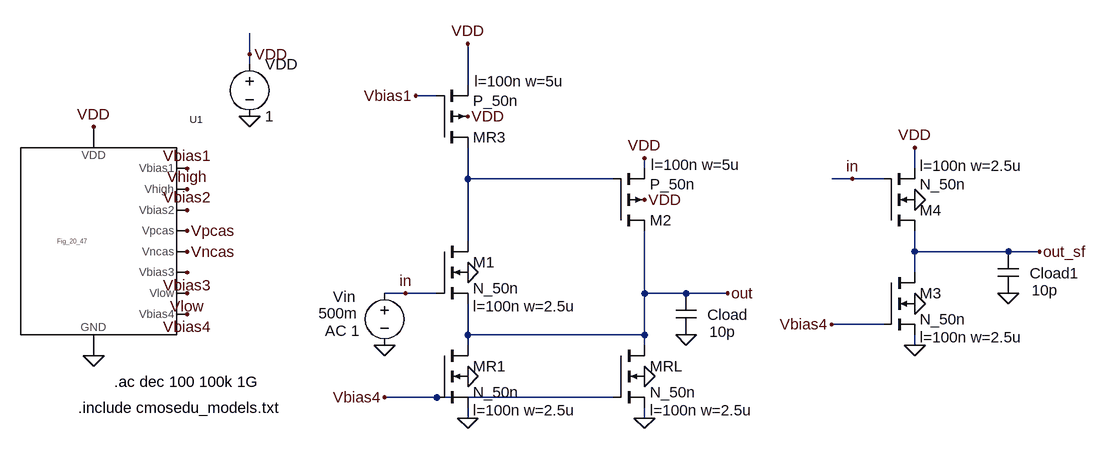
[diagram p0: schematic Fig31_46.asc]
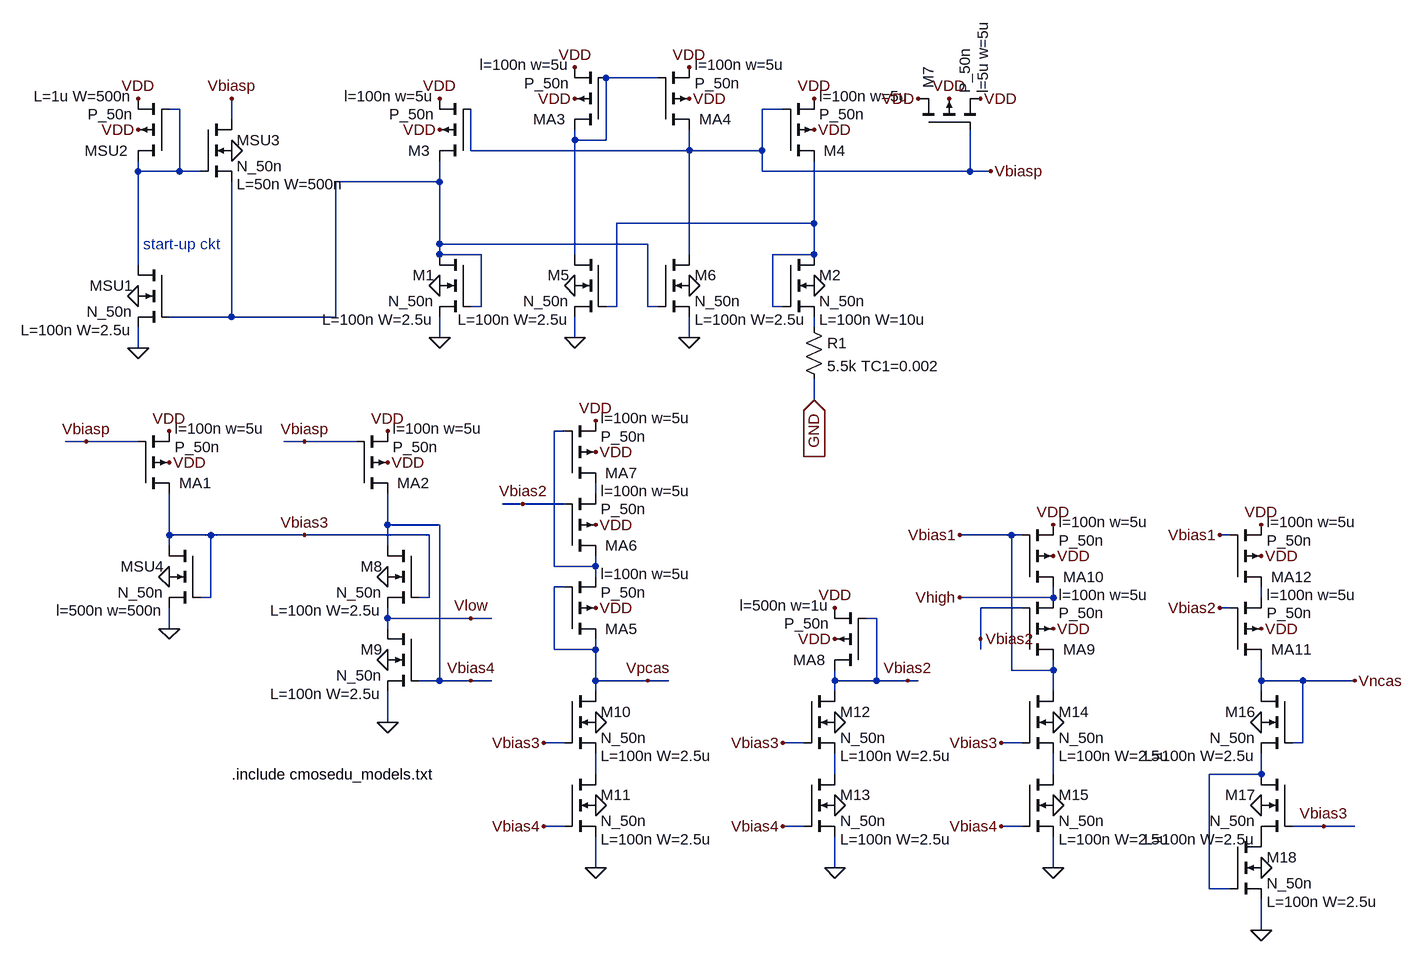
[diagram p1: sub-circuit fig_20_47.asc]
Fig31_46.asc, the LTspice schematic file:
Version 4
SHEET 1 2412 680
WIRE 1040 -352 1040 -384
WIRE 1040 -336 1040 -352
WIRE 1376 -304 1376 -368
WIRE 1328 -288 1296 -288
WIRE 1648 -176 1648 -192
WIRE 2064 -176 2064 -208
WIRE 1376 -160 1376 -208
WIRE 1600 -160 1376 -160
WIRE 1968 -160 1936 -160
WIRE 2016 -160 1968 -160
WIRE 1376 -64 1376 -160
WIRE 2064 -48 2064 -80
WIRE 2208 -48 2064 -48
WIRE 2256 -48 2208 -48
WIRE 2064 -16 2064 -48
WIRE 1280 16 1248 16
WIRE 1328 16 1280 16
WIRE 1648 16 1648 -80
WIRE 1712 16 1648 16
WIRE 1776 16 1712 16
WIRE 2016 64 1936 64
WIRE 1376 80 1376 32
WIRE 1648 80 1648 16
WIRE 1648 80 1376 80
WIRE 1376 96 1376 80
WIRE 1648 96 1648 80
WIRE 2064 96 2064 80
WIRE 1328 176 1248 176
WIRE 1600 176 1328 176
WIRE 1376 208 1376 192
WIRE 1648 208 1648 192
FLAG 1040 -256 0
FLAG 1040 -352 VDD
FLAG 1376 208 0
FLAG 1376 -368 VDD
FLAG 1376 -256 VDD
FLAG 800 -240 VDD
FLAG 800 112 0
FLAG 944 -176 Vbias1
FLAG 944 -144 Vhigh
FLAG 944 -112 Vbias2
FLAG 944 -16 Vbias3
FLAG 944 -80 Vpcas
FLAG 944 -48 Vncas
FLAG 944 48 Vbias4
FLAG 944 16 Vlow
FLAG 1376 144 0
FLAG 1248 176 Vbias4
FLAG 1296 -288 Vbias1
FLAG 1648 -192 VDD
FLAG 1648 -128 VDD
FLAG 1648 208 0
FLAG 1648 144 0
FLAG 1776 16 out
FLAG 1712 80 0
FLAG 1248 96 0
FLAG 1280 16 in
FLAG 2064 96 0
FLAG 2064 -128 0
FLAG 2064 32 0
FLAG 1936 64 Vbias4
FLAG 1968 -160 in
FLAG 2064 -208 VDD
FLAG 2256 -48 out_sf
FLAG 2208 16 0
FLAG 1376 -16 0
SYMBOL voltage 1040 -352 R0
WINDOW 123 0 0 Left 2
WINDOW 39 0 0 Left 2
SYMATTR InstName VDD
SYMATTR Value 1
SYMBOL pmos4 1328 -208 M180
WINDOW 123 58 102 Left 2
WINDOW 0 56 16 Left 2
SYMATTR Value2 l=100n w=5u
SYMATTR InstName MR3
SYMATTR Value P_50n
SYMBOL Fig_20_47 800 -64 R0
SYMATTR InstName U1
SYMBOL nmos4 1328 -64 R0
WINDOW 123 56 100 Left 2
SYMATTR Value2 l=100n w=2.5u
SYMATTR InstName M1
SYMATTR Value N_50n
SYMBOL nmos4 1328 96 R0
WINDOW 123 56 100 Left 2
SYMATTR Value2 l=100n w=2.5u
SYMATTR InstName MR1
SYMATTR Value N_50n
SYMBOL pmos4 1600 -80 M180
WINDOW 123 58 102 Left 2
WINDOW 0 56 16 Left 2
SYMATTR Value2 l=100n w=5u
SYMATTR InstName M2
SYMATTR Value P_50n
SYMBOL nmos4 1600 96 R0
WINDOW 123 56 100 Left 2
SYMATTR Value2 l=100n w=2.5u
SYMATTR InstName MRL
SYMATTR Value N_50n
SYMBOL cap 1696 16 R0
WINDOW 0 49 33 Left 2
WINDOW 3 52 59 Left 2
SYMATTR InstName Cload
SYMATTR Value 10p
SYMBOL voltage 1248 0 R0
WINDOW 0 -79 21 Left 2
WINDOW 3 -102 47 Left 2
WINDOW 123 -92 74 Left 2
WINDOW 39 0 0 Left 2
SYMATTR InstName Vin
SYMATTR Value 500m
SYMATTR Value2 AC 1
SYMBOL nmos4 2016 -80 M180
WINDOW 123 56 100 Left 2
SYMATTR Value2 l=100n w=2.5u
SYMATTR InstName M4
SYMATTR Value N_50n
SYMBOL nmos4 2016 -16 R0
WINDOW 123 56 100 Left 2
SYMATTR Value2 l=100n w=2.5u
SYMATTR InstName M3
SYMATTR Value N_50n
SYMBOL cap 2192 -48 R0
WINDOW 0 49 33 Left 2
WINDOW 3 52 59 Left 2
SYMATTR InstName Cload1
SYMATTR Value 10p
TEXT 776 192 Left 2 !.include cmosedu_models.txt
TEXT 832 152 Left 2 !.ac dec 100 100k 1G

fig_20_47.asc, the sub-circuit schematic file:
Version 4
SHEET 1 2512 1124
WIRE 1344 -208 1264 -208
WIRE 608 -160 592 -160
WIRE 1536 -160 1504 -160
WIRE 688 -144 688 -176
WIRE 1216 -112 1216 -128
WIRE 1264 -112 1264 -208
WIRE 1264 -112 1216 -112
WIRE 1056 -96 1056 -160
WIRE 1392 -96 1392 -128
WIRE 1392 -96 1056 -96
WIRE 1504 -96 1504 -160
WIRE 1504 -96 1392 -96
WIRE 544 -64 544 -80
WIRE 608 -64 608 -160
WIRE 608 -64 544 -64
WIRE 640 -64 608 -64
WIRE 1504 -64 1504 -96
WIRE 1824 -64 1824 -128
WIRE 1824 -64 1504 -64
WIRE 1856 -64 1824 -64
WIRE 1008 -48 1008 -80
WIRE 1008 -48 848 -48
WIRE 1584 16 1584 -80
WIRE 1584 16 1280 16
WIRE 1008 48 1008 -48
WIRE 1328 48 1008 48
WIRE 1008 64 1008 48
WIRE 1072 64 1008 64
WIRE 1216 64 1216 -112
WIRE 1392 64 1392 -96
WIRE 1584 64 1584 16
WIRE 1584 64 1520 64
WIRE 544 80 544 -64
WIRE 1072 144 1072 64
WIRE 1072 144 1056 144
WIRE 1280 144 1280 16
WIRE 1280 144 1264 144
WIRE 1328 144 1328 48
WIRE 1344 144 1328 144
WIRE 1520 144 1520 64
WIRE 1536 144 1520 144
WIRE 688 160 688 -48
WIRE 688 160 592 160
WIRE 848 160 848 -48
WIRE 848 160 688 160
WIRE 1584 176 1584 160
WIRE 1008 192 1008 160
WIRE 1216 192 1216 160
WIRE 1392 192 1392 160
WIRE 544 208 544 176
WIRE 1584 288 1584 256
WIRE 1200 336 1184 336
WIRE 464 352 432 352
WIRE 544 352 464 352
WIRE 800 352 768 352
WIRE 880 352 800 352
WIRE 1248 432 1248 416
WIRE 1136 448 1104 448
WIRE 1200 448 1136 448
WIRE 928 480 928 432
WIRE 1008 480 928 480
WIRE 592 496 592 432
WIRE 656 496 592 496
WIRE 800 496 656 496
WIRE 992 496 800 496
WIRE 1888 496 1808 496
WIRE 1904 496 1888 496
WIRE 2224 496 2208 496
WIRE 592 512 592 496
WIRE 928 512 928 480
WIRE 1184 544 1184 336
WIRE 1248 544 1248 528
WIRE 1248 544 1184 544
WIRE 1248 560 1248 544
WIRE 1200 576 1184 576
WIRE 656 592 656 496
WIRE 656 592 640 592
WIRE 992 592 992 496
WIRE 992 592 976 592
WIRE 1952 592 1952 576
WIRE 1952 592 1808 592
WIRE 2272 592 2272 576
WIRE 1904 608 1840 608
WIRE 2224 608 2208 608
WIRE 928 624 928 608
WIRE 1056 624 928 624
WIRE 1088 624 1056 624
WIRE 1680 624 1664 624
WIRE 592 640 592 608
WIRE 928 640 928 624
WIRE 1840 656 1840 608
WIRE 1184 672 1184 576
WIRE 1248 672 1248 656
WIRE 1248 672 1184 672
WIRE 1840 672 1840 656
WIRE 1888 704 1888 496
WIRE 1952 704 1952 688
WIRE 1952 704 1888 704
WIRE 1008 720 1008 480
WIRE 1008 720 976 720
WIRE 1056 720 1008 720
WIRE 1088 720 1056 720
WIRE 1248 720 1248 672
WIRE 1328 720 1248 720
WIRE 1360 720 1328 720
WIRE 1616 720 1616 704
WIRE 1680 720 1680 624
WIRE 1680 720 1616 720
WIRE 1728 720 1680 720
WIRE 1744 720 1728 720
WIRE 2272 720 2272 688
WIRE 2336 720 2272 720
WIRE 2416 720 2336 720
WIRE 1248 736 1248 720
WIRE 1616 736 1616 720
WIRE 1952 736 1952 704
WIRE 2272 736 2272 720
WIRE 928 784 928 736
WIRE 1200 816 1168 816
WIRE 1568 816 1536 816
WIRE 1904 816 1872 816
WIRE 2336 816 2336 720
WIRE 2336 816 2320 816
WIRE 1248 864 1248 832
WIRE 1616 864 1616 832
WIRE 1952 864 1952 832
WIRE 2272 864 2272 832
WIRE 2272 864 2192 864
WIRE 1200 944 1168 944
WIRE 1568 944 1536 944
WIRE 1904 944 1872 944
WIRE 2368 944 2320 944
WIRE 2416 944 2368 944
WIRE 1248 1008 1248 960
WIRE 1616 1008 1616 960
WIRE 1952 1008 1952 960
WIRE 2192 1040 2192 864
WIRE 2224 1040 2192 1040
WIRE 2272 1104 2272 1056
FLAG 544 -128 VDD
FLAG 544 -176 VDD
FLAG 544 208 0
FLAG 544 128 0
FLAG 688 -96 0
FLAG 688 -176 Vbiasp
FLAG 1008 -128 VDD
FLAG 1008 -176 VDD
FLAG 1584 -128 VDD
FLAG 1584 -176 VDD
FLAG 1856 -64 Vbiasp
FLAG 1008 192 0
FLAG 1008 112 0
FLAG 1584 112 0
FLAG 1392 -176 VDD
FLAG 1392 -224 VDD
FLAG 1216 -176 VDD
FLAG 1216 -224 VDD
FLAG 1216 112 0
FLAG 1392 112 0
FLAG 1216 192 0
FLAG 1392 192 0
FLAG 1792 -176 VDD
FLAG 1744 -176 VDD
FLAG 1840 -176 VDD
FLAG 592 384 VDD
FLAG 592 336 VDD
FLAG 464 352 Vbiasp
FLAG 928 384 VDD
FLAG 928 336 VDD
FLAG 800 352 Vbiasp
FLAG 592 640 0
FLAG 592 560 0
FLAG 928 560 0
FLAG 928 688 0
FLAG 928 784 0
FLAG 800 496 Vbias3
FLAG 1248 784 0
FLAG 1248 912 0
FLAG 1248 1008 0
FLAG 1056 624 Vlow
FLAG 1056 720 Vbias4
FLAG 1168 816 Vbias3
FLAG 1168 944 Vbias4
FLAG 1616 784 0
FLAG 1616 912 0
FLAG 1616 1008 0
FLAG 1536 816 Vbias3
FLAG 1536 944 Vbias4
FLAG 1952 784 0
FLAG 1952 912 0
FLAG 1952 1008 0
FLAG 1872 816 Vbias3
FLAG 1872 944 Vbias4
FLAG 1248 608 VDD
FLAG 1328 720 Vpcas
FLAG 1248 480 VDD
FLAG 1248 368 VDD
FLAG 1248 320 VDD
FLAG 1136 448 Vbias2
FLAG 1616 656 VDD
FLAG 1616 608 VDD
FLAG 1728 720 Vbias2
FLAG 1952 640 VDD
FLAG 1952 528 VDD
FLAG 1952 480 VDD
FLAG 1808 496 Vbias1
FLAG 1808 592 Vhigh
FLAG 2272 640 VDD
FLAG 2272 528 VDD
FLAG 2272 480 VDD
FLAG 2208 496 Vbias1
FLAG 2208 608 Vbias2
FLAG 2272 784 0
FLAG 2272 912 0
FLAG 2272 1008 0
FLAG 2272 1104 0
FLAG 2416 720 Vncas
FLAG 2368 944 Vbias3
FLAG 1584 288 GND
IOPIN 1584 288 In
FLAG 1840 656 Vbias2
SYMBOL pmos4 592 -80 R180
WINDOW 0 63 16 Left 2
WINDOW 123 56 100 Left 2
SYMATTR InstName MSU2
SYMATTR Value2 L=1u W=500n
SYMATTR Value P_50n
SYMBOL nmos4 592 80 M0
WINDOW 123 56 100 Left 2
SYMATTR Value2 L=100n W=2.5u
SYMATTR InstName MSU1
SYMATTR Value N_50n
SYMBOL nmos4 640 -144 R0
WINDOW 123 56 100 Left 2
SYMATTR Value2 L=50n W=500n
SYMATTR InstName MSU3
SYMATTR Value N_50n
SYMBOL pmos4 1056 -80 R180
WINDOW 0 63 16 Left 2
WINDOW 123 56 100 Left 2
SYMATTR InstName M3
SYMATTR Value2 l=100n w=5u
SYMATTR Value P_50n
SYMBOL pmos4 1536 -80 M180
WINDOW 0 63 16 Left 2
WINDOW 123 56 100 Left 2
SYMATTR InstName M4
SYMATTR Value2 l=100n w=5u
SYMATTR Value P_50n
SYMBOL nmos4 1056 64 M0
WINDOW 123 56 100 Left 2
SYMATTR Value2 L=100n W=2.5u
SYMATTR InstName M1
SYMATTR Value N_50n
SYMBOL nmos4 1536 64 R0
WINDOW 123 56 100 Left 2
SYMATTR Value2 L=100n W=10u
SYMATTR InstName M2
SYMATTR Value N_50n
SYMBOL res 1568 160 R0
SYMATTR InstName R1
SYMATTR Value 5.5k TC1=0.002
SYMBOL pmos4 1344 -128 M180
WINDOW 0 63 16 Left 2
WINDOW 123 56 100 Left 2
SYMATTR InstName MA4
SYMATTR Value2 l=100n w=5u
SYMATTR Value P_50n
SYMBOL pmos4 1264 -128 R180
WINDOW 0 63 16 Left 2
WINDOW 123 56 100 Left 2
SYMATTR InstName MA3
SYMATTR Value2 l=100n w=5u
SYMATTR Value P_50n
SYMBOL nmos4 1264 64 M0
WINDOW 123 56 100 Left 2
SYMATTR Value2 L=100n W=2.5u
SYMATTR InstName M5
SYMATTR Value N_50n
SYMBOL nmos4 1344 64 R0
WINDOW 123 56 100 Left 2
SYMATTR Value2 L=100n W=2.5u
SYMATTR InstName M6
SYMATTR Value N_50n
SYMBOL pmos4 1744 -128 R270
WINDOW 0 63 16 Left 2
WINDOW 123 56 100 Left 2
SYMATTR InstName M7
SYMATTR Value2 l=5u w=5u
SYMATTR Value P_50n
SYMBOL pmos4 544 432 M180
WINDOW 0 63 16 Left 2
WINDOW 123 56 100 Left 2
SYMATTR InstName MA1
SYMATTR Value2 l=100n w=5u
SYMATTR Value P_50n
SYMBOL pmos4 880 432 M180
WINDOW 0 63 16 Left 2
WINDOW 123 56 100 Left 2
SYMATTR InstName MA2
SYMATTR Value2 l=100n w=5u
SYMATTR Value P_50n
SYMBOL nmos4 640 512 M0
WINDOW 123 56 100 Left 2
SYMATTR Value2 l=500n w=500n
SYMATTR InstName MSU4
SYMATTR Value N_50n
SYMBOL nmos4 976 512 M0
WINDOW 123 56 100 Left 2
SYMATTR Value2 L=100n W=2.5u
SYMATTR InstName M8
SYMATTR Value N_50n
SYMBOL nmos4 976 640 M0
WINDOW 123 56 100 Left 2
SYMATTR Value2 L=100n W=2.5u
SYMATTR InstName M9
SYMATTR Value N_50n
SYMBOL nmos4 1200 736 R0
WINDOW 123 56 100 Left 2
SYMATTR Value2 L=100n W=2.5u
SYMATTR InstName M10
SYMATTR Value N_50n
SYMBOL nmos4 1200 864 R0
WINDOW 123 56 100 Left 2
SYMATTR Value2 L=100n W=2.5u
SYMATTR InstName M11
SYMATTR Value N_50n
SYMBOL nmos4 1568 736 R0
WINDOW 123 56 100 Left 2
SYMATTR Value2 L=100n W=2.5u
SYMATTR InstName M12
SYMATTR Value N_50n
SYMBOL nmos4 1568 864 R0
WINDOW 123 56 100 Left 2
SYMATTR Value2 L=100n W=2.5u
SYMATTR InstName M13
SYMATTR Value N_50n
SYMBOL nmos4 1904 736 R0
WINDOW 123 56 100 Left 2
SYMATTR Value2 L=100n W=2.5u
SYMATTR InstName M14
SYMATTR Value N_50n
SYMBOL nmos4 1904 864 R0
WINDOW 123 56 100 Left 2
SYMATTR Value2 L=100n W=2.5u
SYMATTR InstName M15
SYMATTR Value N_50n
SYMBOL pmos4 1200 656 M180
WINDOW 0 63 16 Left 2
WINDOW 123 56 100 Left 2
SYMATTR InstName MA5
SYMATTR Value2 l=100n w=5u
SYMATTR Value P_50n
SYMBOL pmos4 1200 528 M180
WINDOW 0 63 16 Left 2
WINDOW 123 56 100 Left 2
SYMATTR InstName MA6
SYMATTR Value2 l=100n w=5u
SYMATTR Value P_50n
SYMBOL pmos4 1200 416 M180
WINDOW 0 63 16 Left 2
WINDOW 123 56 100 Left 2
SYMATTR InstName MA7
SYMATTR Value2 l=100n w=5u
SYMATTR Value P_50n
SYMBOL pmos4 1664 704 R180
WINDOW 0 63 16 Left 2
WINDOW 123 56 100 Left 2
SYMATTR InstName MA8
SYMATTR Value2 l=500n w=1u
SYMATTR Value P_50n
SYMBOL pmos4 1904 688 M180
WINDOW 0 63 16 Left 2
WINDOW 123 56 100 Left 2
SYMATTR InstName MA9
SYMATTR Value2 l=100n w=5u
SYMATTR Value P_50n
SYMBOL pmos4 1904 576 M180
WINDOW 0 63 16 Left 2
WINDOW 123 56 100 Left 2
SYMATTR InstName MA10
SYMATTR Value2 l=100n w=5u
SYMATTR Value P_50n
SYMBOL pmos4 2224 688 M180
WINDOW 0 63 16 Left 2
WINDOW 123 56 100 Left 2
SYMATTR InstName MA11
SYMATTR Value2 l=100n w=5u
SYMATTR Value P_50n
SYMBOL pmos4 2224 576 M180
WINDOW 0 63 16 Left 2
WINDOW 123 56 100 Left 2
SYMATTR InstName MA12
SYMATTR Value2 l=100n w=5u
SYMATTR Value P_50n
SYMBOL nmos4 2320 736 M0
WINDOW 123 56 100 Left 2
SYMATTR Value2 L=100n W=2.5u
SYMATTR InstName M16
SYMATTR Value N_50n
SYMBOL nmos4 2320 864 M0
WINDOW 123 56 100 Left 2
SYMATTR Value2 L=100n W=2.5u
SYMATTR InstName M17
SYMATTR Value N_50n
SYMBOL nmos4 2224 960 R0
WINDOW 123 56 100 Left 2
SYMATTR Value2 L=100n W=2.5u
SYMATTR InstName M18
SYMATTR Value N_50n
TEXT 552 48 Left 2 ;start-up ckt
TEXT 688 864 Left 2 !.include cmosedu_models.txt

The netlist it stands for:
* Fig31_46.asc
VDD VDD 0 1
MR3 N001 Vbias1 VDD VDD P_50n l=100n w=5u
XU1 Vbias1 Vhigh Vbias2 Vpcas Vncas Vbias3 Vlow Vbias4 VDD 0 fig_20_47
M1 N001 in out 0 N_50n l=100n w=2.5u
MR1 out Vbias4 0 0 N_50n l=100n w=2.5u
M2 out N001 VDD VDD P_50n l=100n w=5u
MRL out Vbias4 0 0 N_50n l=100n w=2.5u
Cload out 0 10p
Vin in 0 500m AC 1
M4 out_sf in VDD 0 N_50n l=100n w=2.5u
M3 out_sf Vbias4 0 0 N_50n l=100n w=2.5u
Cload1 out_sf 0 10p

* block symbol definitions
.subckt fig_20_47 Vbias1 Vhigh Vbias2 Vpcas Vncas Vbias3 Vlow Vbias4 VDD GND
MSU2 N002 N002 VDD VDD P_50n L=1u W=500n
MSU1 N002 N003 0 0 N_50n L=100n W=2.5u
MSU3 Vbiasp N002 N003 0 N_50n L=50n W=500n
M3 N003 Vbiasp VDD VDD P_50n l=100n w=5u
M4 N004 Vbiasp VDD VDD P_50n l=100n w=5u
M1 N003 N003 0 0 N_50n L=100n W=2.5u
M2 N004 N004 N005 0 N_50n L=100n W=10u
R1 N005 GND 5.5k TC1=0.002
MA4 Vbiasp N001 VDD VDD P_50n l=100n w=5u
MA3 N001 N001 VDD VDD P_50n l=100n w=5u
M5 N001 N004 0 0 N_50n L=100n W=2.5u
M6 Vbiasp N003 0 0 N_50n L=100n W=2.5u
M7 VDD Vbiasp VDD VDD P_50n l=5u w=5u
MA1 Vbias3 Vbiasp VDD VDD P_50n l=100n w=5u
MA2 Vbias4 Vbiasp VDD VDD P_50n l=100n w=5u
MSU4 Vbias3 Vbias3 0 0 N_50n l=500n w=500n
M8 Vbias4 Vbias3 Vlow 0 N_50n L=100n W=2.5u
M9 Vlow Vbias4 0 0 N_50n L=100n W=2.5u
M10 Vpcas Vbias3 N009 0 N_50n L=100n W=2.5u
M11 N009 Vbias4 0 0 N_50n L=100n W=2.5u
M12 Vbias2 Vbias3 N010 0 N_50n L=100n W=2.5u
M13 N010 Vbias4 0 0 N_50n L=100n W=2.5u
M14 Vbias1 Vbias3 N011 0 N_50n L=100n W=2.5u
M15 N011 Vbias4 0 0 N_50n L=100n W=2.5u
MA5 Vpcas Vpcas N006 VDD P_50n l=100n w=5u
MA6 N006 Vbias2 N007 VDD P_50n l=100n w=5u
MA7 N007 N006 VDD VDD P_50n l=100n w=5u
MA8 Vbias2 Vbias2 VDD VDD P_50n l=500n w=1u
MA9 Vbias1 Vbias2 Vhigh VDD P_50n l=100n w=5u
MA10 Vhigh Vbias1 VDD VDD P_50n l=100n w=5u
MA11 Vncas Vbias2 N008 VDD P_50n l=100n w=5u
MA12 N008 Vbias1 VDD VDD P_50n l=100n w=5u
M16 Vncas Vncas N012 0 N_50n L=100n W=2.5u
M17 N012 Vbias3 P001 0 N_50n L=100n W=2.5u
M18 P001 N012 0 0 N_50n L=100n W=2.5u
* start-up ckt
.include cmosedu_models.txt
.ends fig_20_47

.model NMOS NMOS
.model PMOS PMOS
.lib standard.mos
.include cmosedu_models.txt
.ac dec 100 100k 1G
.backanno
.end